# EAGLE design schema project robot (EAGLE 8.7.0)
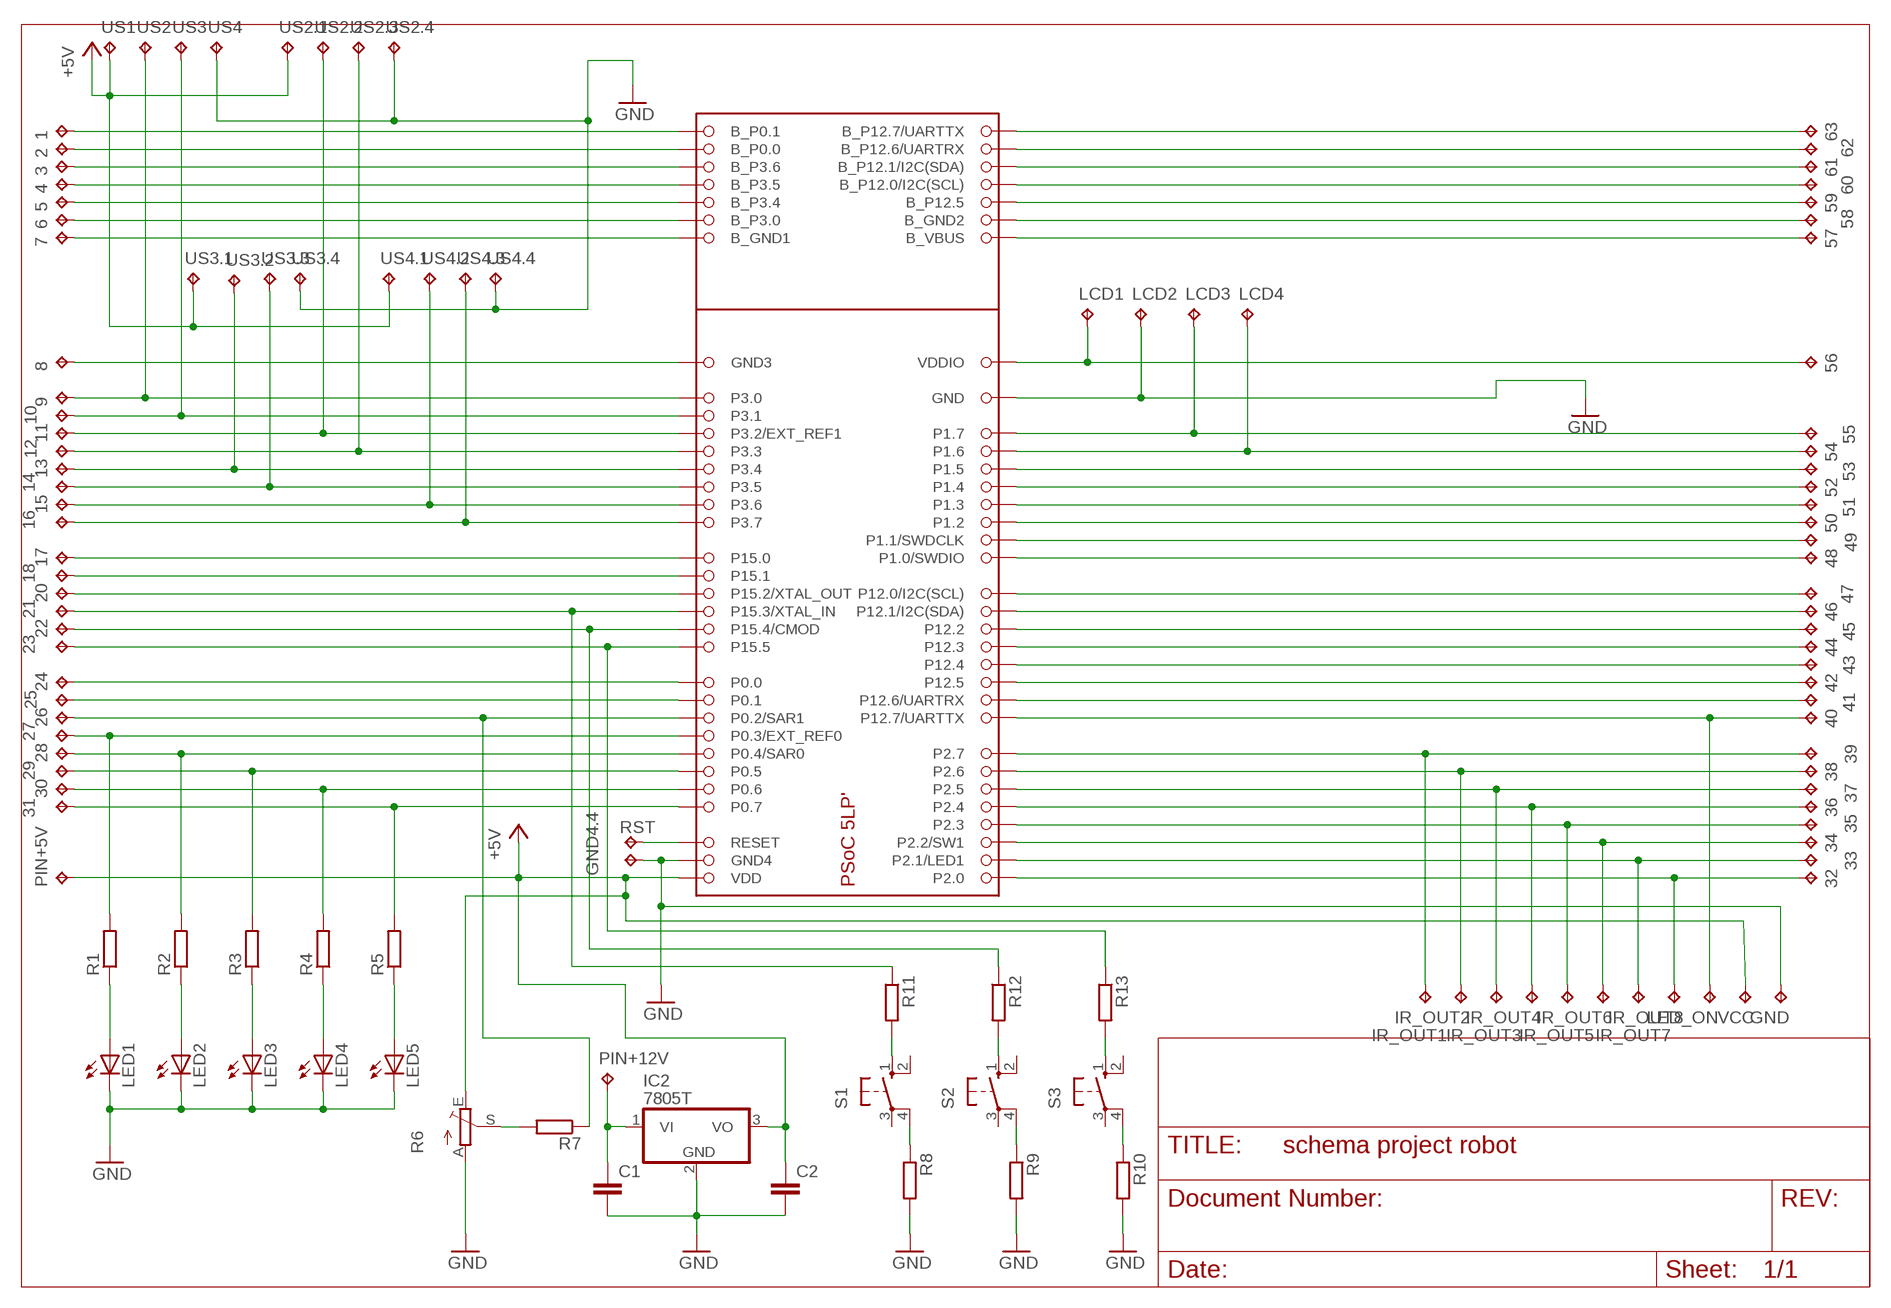
[diagram p0: schematic, sheet 1]

## Parts
1  TPPAD1-13Y  [P1-13Y]
2  TPPAD1-13Y  [P1-13Y]
3  TPPAD1-13Y  [P1-13Y]
4  TPPAD1-13Y  [P1-13Y]
5  TPPAD1-13Y  [P1-13Y]
6  TPPAD1-13Y  [P1-13Y]
7  TPPAD1-13Y  [P1-13Y]
8  TPPAD1-13Y  [P1-13Y]
9  TPPAD1-13Y  [P1-13Y]
10  TPPAD1-13Y  [P1-13Y]
11  TPPAD1-13Y  [P1-13Y]
12  TPPAD1-13Y  [P1-13Y]
13  TPPAD1-13Y  [P1-13Y]
14  TPPAD1-13Y  [P1-13Y]
15  TPPAD1-13Y  [P1-13Y]
16  TPPAD1-13Y  [P1-13Y]
17  TPPAD1-13Y  [P1-13Y]
18  TPPAD1-13Y  [P1-13Y]
20  TPPAD1-13Y  [P1-13Y]
21  TPPAD1-13Y  [P1-13Y]
22  TPPAD1-13Y  [P1-13Y]
23  TPPAD1-13Y  [P1-13Y]
24  TPPAD1-13Y  [P1-13Y]
25  TPPAD1-13Y  [P1-13Y]
26  TPPAD1-13Y  [P1-13Y]
27  TPPAD1-13Y  [P1-13Y]
28  TPPAD1-13Y  [P1-13Y]
29  TPPAD1-13Y  [P1-13Y]
30  TPPAD1-13Y  [P1-13Y]
31  TPPAD1-13Y  [P1-13Y]
32  TPPAD1-13Y  [P1-13Y]
33  TPPAD1-13Y  [P1-13Y]
34  TPPAD1-13Y  [P1-13Y]
35  TPPAD1-13Y  [P1-13Y]
36  TPPAD1-13Y  [P1-13Y]
37  TPPAD1-13Y  [P1-13Y]
38  TPPAD1-13Y  [P1-13Y]
39  TPPAD1-13Y  [P1-13Y]
40  TPPAD1-13Y  [P1-13Y]
41  TPPAD1-13Y  [P1-13Y]
42  TPPAD1-13Y  [P1-13Y]
43  TPPAD1-13Y  [P1-13Y]
44  TPPAD1-13Y  [P1-13Y]
45  TPPAD1-13Y  [P1-13Y]
46  TPPAD1-13Y  [P1-13Y]
47  TPPAD1-13Y  [P1-13Y]
48  TPPAD1-13Y  [P1-13Y]
49  TPPAD1-13Y  [P1-13Y]
50  TPPAD1-13Y  [P1-13Y]
51  TPPAD1-13Y  [P1-13Y]
52  TPPAD1-13Y  [P1-13Y]
53  TPPAD1-13Y  [P1-13Y]
54  TPPAD1-13Y  [P1-13Y]
55  TPPAD1-13Y  [P1-13Y]
56  TPPAD1-13Y  [P1-13Y]
57  TPPAD1-13Y  [P1-13Y]
58  TPPAD1-13Y  [P1-13Y]
59  TPPAD1-13Y  [P1-13Y]
60  TPPAD1-13Y  [P1-13Y]
61  TPPAD1-13Y  [P1-13Y]
62  TPPAD1-13Y  [P1-13Y]
63  TPPAD1-13Y  [P1-13Y]
C1  C-EU050-035X075  [C050-035X075]
C2  C-EU050-035X075  [C050-035X075]
DEVICE1  CYPRESSFOOTPRINT_CYPRESS  [CYPRESSFOOTPRINT_CYPRESSFOOTPRINT]
GND  TPPAD1-13Y  [P1-13Y]
GND4.4  TPPAD1-13Y  [P1-13Y]
IC2  7805T  [TO220H]
IR_OUT1  TPPAD1-13Y  [P1-13Y]
IR_OUT2  TPPAD1-13Y  [P1-13Y]
IR_OUT3  TPPAD1-13Y  [P1-13Y]
IR_OUT4  TPPAD1-13Y  [P1-13Y]
IR_OUT5  TPPAD1-13Y  [P1-13Y]
IR_OUT6  TPPAD1-13Y  [P1-13Y]
IR_OUT7  TPPAD1-13Y  [P1-13Y]
IR_OUT8  TPPAD1-13Y  [P1-13Y]
LCD1  TPPAD1-13Y  [P1-13Y]
LCD2  TPPAD1-13Y  [P1-13Y]
LCD3  TPPAD1-13Y  [P1-13Y]
LCD4  TPPAD1-13Y  [P1-13Y]
LED1  LED5MM  [LED5MM]
LED2  LED5MM  [LED5MM]
LED3  LED5MM  [LED5MM]
LED4  LED5MM  [LED5MM]
LED5  LED5MM  [LED5MM]
LED_ON  TPPAD1-13Y  [P1-13Y]
PIN+5V  TPPAD1-13Y  [P1-13Y]
PIN+12V  TPPAD1-13Y  [P1-13Y]
R1  R-EU_0204/7  [0204/7]
R2  R-EU_0204/7  [0204/7]
R3  R-EU_0204/7  [0204/7]
R4  R-EU_0204/7  [0204/7]
R5  R-EU_0204/7  [0204/7]
R6  TRIM_EU-CIP20C-6MM  [CIP20C-6MM]
R7  R-EU_0204/7  [0204/7]
R8  R-EU_0204/7  [0204/7]
R9  R-EU_0204/7  [0204/7]
R10  R-EU_0204/7  [0204/7]
R11  R-EU_0204/7  [0204/7]
R12  R-EU_0204/7  [0204/7]
R13  R-EU_0204/7  [0204/7]
RST  TPPAD1-13Y  [P1-13Y]
S1  10-XX  [B3F-10XX]
S2  10-XX  [B3F-10XX]
S3  10-XX  [B3F-10XX]
US1  TPPAD1-13Y  [P1-13Y]
US2  TPPAD1-13Y  [P1-13Y]
US2.1  TPPAD1-13Y  [P1-13Y]
US2.2  TPPAD1-13Y  [P1-13Y]
US2.3  TPPAD1-13Y  [P1-13Y]
US2.4  TPPAD1-13Y  [P1-13Y]
US3  TPPAD1-13Y  [P1-13Y]
US3.1  TPPAD1-13Y  [P1-13Y]
US3.2  TPPAD1-13Y  [P1-13Y]
US3.3  TPPAD1-13Y  [P1-13Y]
US3.4  TPPAD1-13Y  [P1-13Y]
US4  TPPAD1-13Y  [P1-13Y]
US4.1  TPPAD1-13Y  [P1-13Y]
US4.2  TPPAD1-13Y  [P1-13Y]
US4.3  TPPAD1-13Y  [P1-13Y]
US4.4  TPPAD1-13Y  [P1-13Y]
VCC  TPPAD1-13Y  [P1-13Y]

## Nets
+5V: C2.1 DEVICE1.VVD(VDD) IC2.3(VO) PIN+5V.TP R6.E US1.TP US2.1.TP US3.1.TP US4.1.TP VCC.TP
GND: C1.2 C2.2 DEVICE1.GND DEVICE1.GND4 GND4.4.TP GND.TP IC2.2(GND) LCD2.TP LED1.K(C) LED2.K(C) LED3.K(C) LED4.K(C) LED5.K(C) R6.A R8.2 R9.2 R10.2 US2.4.TP US3.4.TP US4.4.TP US4.TP
N$1: LED1.A R1.1
N$2: LED2.A R2.1
N$3: LED3.A R3.1
N$4: LED4.A R4.1
N$5: LED5.A R5.1
N$6: 31.TP DEVICE1.P0.7 R5.2
N$7: 30.TP DEVICE1.P0.6 R4.2
N$8: 29.TP DEVICE1.P0.5 R3.2
N$9: 25.TP DEVICE1.P0.1
N$10: 24.TP DEVICE1.P0.0
N$11: 1.TP DEVICE1.B_P0.1
N$12: 2.TP DEVICE1.B_P0.0
N$13: 3.TP DEVICE1.B_P3.6
N$14: 4.TP DEVICE1.B_P3.5
N$15: 5.TP DEVICE1.B_P3.4
N$16: 6.TP DEVICE1.B_P3.0
N$17: 7.TP DEVICE1.B_GND1
N$18: 8.TP DEVICE1.GND3
N$19: 9.TP DEVICE1.P3.0 US2.TP
N$20: 10.TP DEVICE1.P3.1 US3.TP
N$21: 11.TP DEVICE1.P3.2(P3.2/EXT_REF1) US2.2.TP
N$22: 12.TP DEVICE1.P3.3 US2.3.TP
N$23: 16.TP DEVICE1.P3.7 US4.3.TP
N$24: 15.TP DEVICE1.P3.6 US4.2.TP
N$25: C1.1 IC2.1(VI) PIN+12V.TP
N$26: 14.TP DEVICE1.P3.5 US3.3.TP
N$27: 17.TP DEVICE1.P15.0
N$28: 18.TP DEVICE1.P15.1
N$29: 20.TP DEVICE1.P15.2/XTAL_OUT
N$30: 21.TP DEVICE1.P15.3/XTAL_IN R11.1
N$31: 22.TP DEVICE1.P15.4/CMOD R12.1
N$32: 23.TP DEVICE1.P15.5 R13.1
N$33: 26.TP DEVICE1.P0.2/SAR1 R7.1
N$34: 27.TP DEVICE1.P0.3/EXT_REF0 R1.2
N$35: 28.TP DEVICE1.P0.4/SAR0 R2.2
N$36: DEVICE1.RESET RST.TP
N$37: 13.TP DEVICE1.P3.4 US3.2.TP
N$38: 32.TP DEVICE1.P2.0 IR_OUT8.TP
N$39: 33.TP DEVICE1.P2.1/LED1 IR_OUT7.TP
N$40: 34.TP DEVICE1.P2.2/SW1 IR_OUT6.TP
N$41: 35.TP DEVICE1.P2.3 IR_OUT5.TP
N$42: 36.TP DEVICE1.P2.4 IR_OUT4.TP
N$43: 37.TP DEVICE1.P2.5 IR_OUT3.TP
N$44: 38.TP DEVICE1.P2.6 IR_OUT2.TP
N$45: 39.TP DEVICE1.P2.7 IR_OUT1.TP
N$46: 40.TP DEVICE1.P12.7/UARTTX LED_ON.TP
N$47: 41.TP DEVICE1.P12.6/UARTRX
N$48: 42.TP DEVICE1.P12.5
N$49: 43.TP DEVICE1.P12.4
N$50: 44.TP DEVICE1.P12.3
N$51: 45.TP DEVICE1.P12.2
N$52: 46.TP DEVICE1.P12.1/I2C(SDA)
N$53: 47.TP DEVICE1.P12.0/I2C(SCL)
N$54: 48.TP DEVICE1.P1.0/SWDIO
N$55: 49.TP DEVICE1.P1.1/SWDCLK
N$56: 50.TP DEVICE1.P1.2
N$57: 51.TP DEVICE1.P1.3
N$58: 52.TP DEVICE1.P1.4
N$59: 53.TP DEVICE1.P1.5
N$60: 54.TP DEVICE1.P1.6 LCD4.TP
N$61: 55.TP DEVICE1.P1.7 LCD3.TP
N$62: R6.S R7.2
N$63: 57.TP DEVICE1.B_VBUS
N$64: 58.TP DEVICE1.B_GND2
N$65: 59.TP DEVICE1.B_P12.5
N$66: 60.TP DEVICE1.B_12.0/I2C(SCL)(B_P12.0/I2C(SCL))
N$67: 61.TP DEVICE1.B_12.1/I2C(SDA)(B_P12.1/I2C(SDA))
N$68: 62.TP DEVICE1.B_12.6/UARTRX(B_P12.6/UARTRX)
N$69: 63.TP DEVICE1.B_12.7/UARTTX(B_P12.7/UARTTX)
N$70: R8.1 S1.4(P1)
N$71: R9.1 S2.4(P1)
N$72: R10.1 S3.4(P1)
N$73: R13.2 S3.1(S)
N$74: R12.2 S2.1(S)
N$75: R11.2 S1.1(S)
N$76: 56.TP DEVICE1.VDDIO LCD1.TP
Unconnected: S1.2(S1) S1.3(P) S2.2(S1) S2.3(P) S3.2(S1) S3.3(P)

## Library data of the parts
1-18 20-63 GND GND4.4 IR_OUT1-IR_OUT8 LCD1-LCD4 LED_ON PIN+5V PIN+12V RST US1 US2 US2.1-US2.4 US3 US3.1-US3.4 US4 US4.1-US4.4 VCC = testpad:TP: Test pad
C1 C2 = rcl:C-EU: CAPACITOR, European symbol; SPICEPREFIX: C
DEVICE1 = Board_1_23:CYPRESSFOOTPRINT_CYPRESS
IC2 = linear:78*: Positive VOLTAGE REGULATOR Source: http://cache.national.com/ds/LM/LM78L05.pdf http://www.fairchildsemi.com/ds/LM/LM7805.pdf
LED1-LED5 = led:LED: LED OSRAM: - CHIPLED LG R971, LG N971, LY N971, LG Q971, LY Q971, LO R971, LY R971 LH N974, LH R974 LS Q976, LO Q976, LY Q976 LO Q996 - Hyper CHIPLED LW Q18S LB Q993, LB Q99A, LB R99A - SideLED LS A670, LO A670, LY A670, LG A670, LP A670 LB A673, LV A673, LT A673, LW A673 LH A674 LY A675 LS A676, LA A676, LO A676, LY A676, LW A676 LS A679, LY A679, LG A679 - Hyper Micro SIDELED® LS Y876, LA Y876, LO Y876, LY Y876 LT Y87S - SmartLED LW L88C, LW L88S LB L89C, LB L89S, LG L890 LS L89K, LO L89K, LY L89K LS L896, LA L896, LO L896, LY L896 - TOPLED LS T670, LO T670, LY T670, LG T670, LP T670 LSG T670, LSP T670, LSY T670, LOP T670, LYG T670 LG T671, LOG T671, LSG T671 LB T673, LV T673, LT T673, LW T673 LH T674 LS T676, LA T676, LO T676, LY T676, LB T676, LH T676, LSB T676, LW T676 LB T67C, LV T67C, LT T67C, LS T67K, LO T67K, LY T67K, LW E67C LS E67B, LA E67B, LO E67B, LY E67B, LB E67C, LV E67C, LT E67C LW T67C LS T679, LY T679, LG T679 LS T770, LO T770, LY T770, LG T770, LP T770 LB T773, LV T773, LT T773, LW T773 LH T774 LS E675, LA E675, LY E675, LS T675 LS T776, LA T776, LO T776, LY T776, LB T776 LHGB T686 LT T68C, LB T68C - Hyper Mini TOPLED® LB M676 - Mini TOPLED Santana® LG M470 LS M47K, LO M47K, LY M47K Source: http://www.osram.convergy.de LUXEON: - LUMILED® LXK2-PW12-R00, LXK2-PW12-S00, LXK2-PW14-U00, LXK2-PW14-V00 LXK2-PM12-R00, LXK2-PM12-S00, LXK2-PM14-U00 LXK2-PE12-Q00, LXK2-PE12-R00, LXK2-PE12-S00, LXK2-PE14-T00, LXK2-PE14-U00 LXK2-PB12-K00, LXK2-PB12-L00, LXK2-PB12-M00, LXK2-PB14-N00, LXK2-PB14-P00, LXK2-PB14-Q00 LXK2-PR12-L00, LXK2-PR12-M00, LXK2-PR14-Q00, LXK2-PR14-R00 LXK2-PD12-Q00, LXK2-PD12-R00, LXK2-PD12-S00 LXK2-PH12-R00, LXK2-PH12-S00 LXK2-PL12-P00, LXK2-PL12-Q00, LXK2-PL12-R00 Source: www.luxeon.com KINGBRIGHT: KA-3528ASYC Source: www.kingbright.com
R1-R5 R7-R13 = rcl:R-EU_: RESISTOR, European symbol; SPICEPREFIX: R
R6 = pot:TRIM_EU-: POTENTIOMETER
S1-S3 = switch-omron:10-XX: OMRON SWITCH; MPN: B3F-1000; OC_FARNELL: 176432; OC_NEWARK: 36M3542

## Board
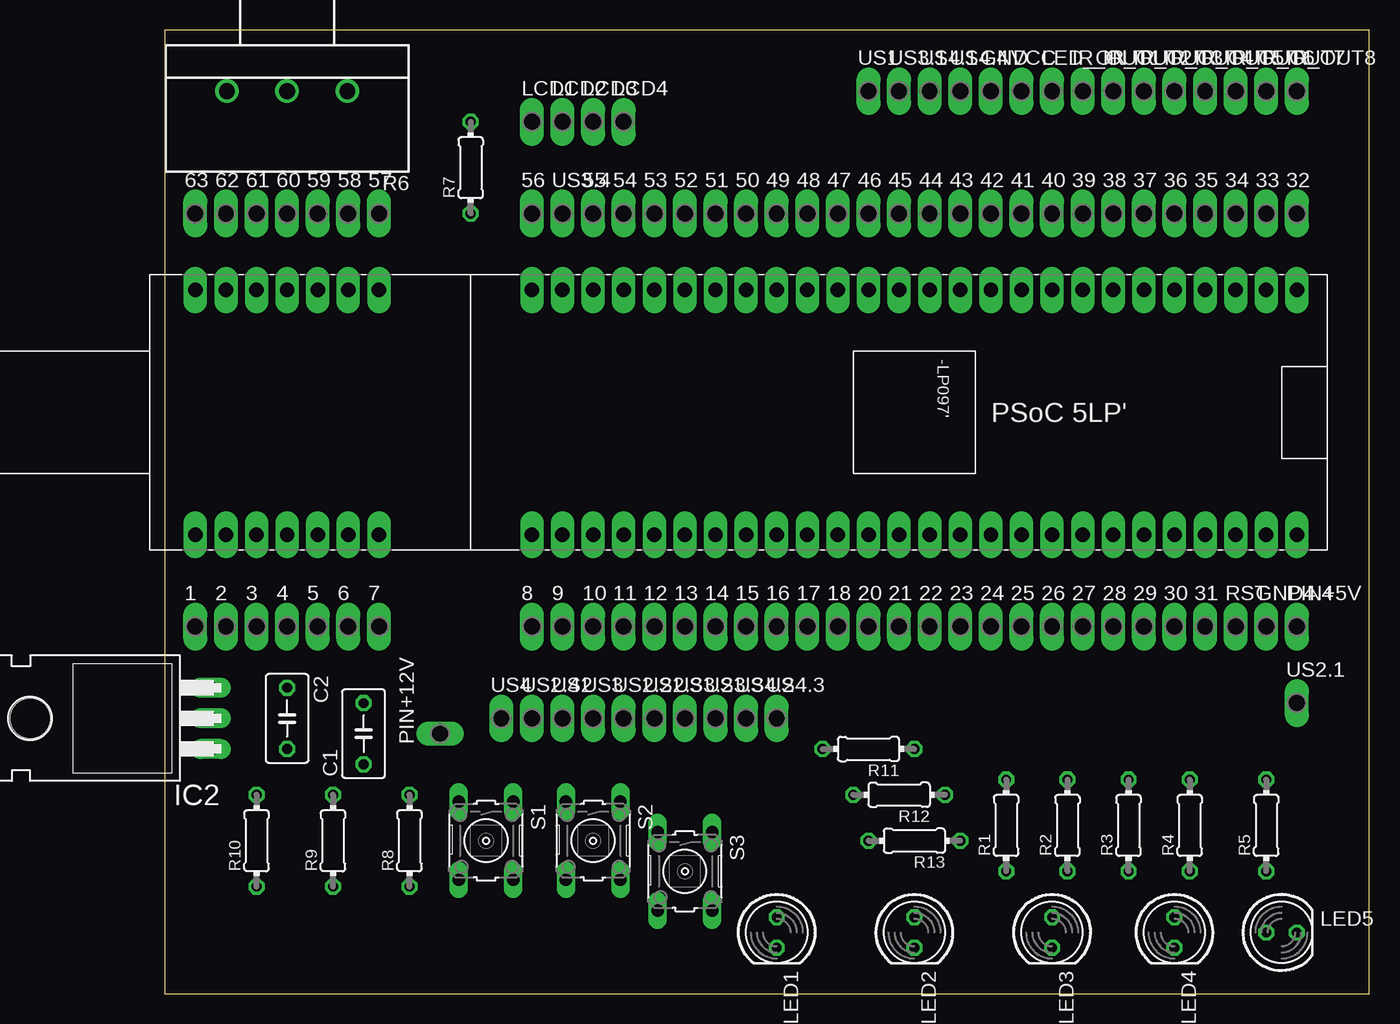
[diagram p1: board, top side]
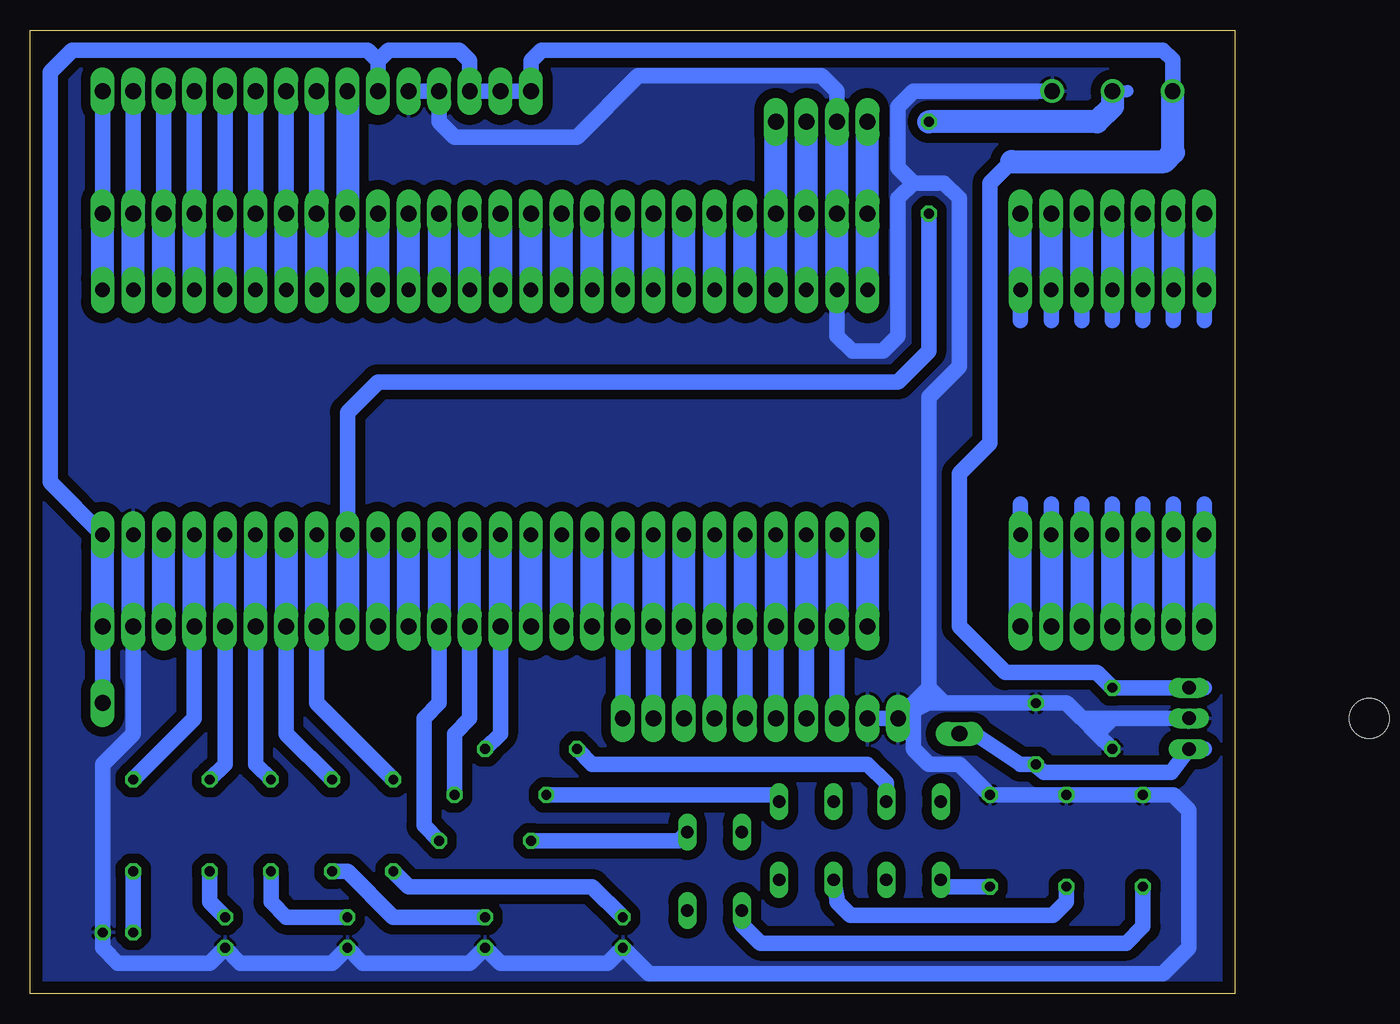
[diagram p2: board, bottom side, seen from below]

Size 100 x 80 mm. Coordinates in mm from the lower left corner, seen from the top.
Outline: 0,0 100,0 100,80 0,80 0,0
Copper layers (1*16): Top 0.035mm / dielectric 1.5mm / Bottom 0.035mm
Design rules "default": minimum track width 6mil, minimum drill 0.35mm, track to track 6mil, track to pad 6mil, pad to pad 6mil, via to via 6mil, smd to smd 6mil, copper to edge 40mil, drill to drill 6mil, minimum pad ring 10mil, minimum via ring 8mil, stop-mask expansion 4mil, vias tented up to drill 0mil, thermal gap 10mil

### Footprints (pad centres in the part's own frame; a part is rotated, then mirrored left to right if it is on the bottom)
P1-13Y = drill 1.321 pad 1.905 long: TP 0,0
C050-035X075 = drill 0.813 octagon: 1 -2.54,0; 2 2.54,0
CYPRESSFOOTPRINT_CYPRESSFOOTPRINT = drill 1.2 pad 1.93 long: B_12.0/I2C(SCL) -36.83,10.16; B_12.1/I2C(SDA) -39.37,10.16; B_12.6/UARTRX -41.91,10.16; B_12.7/UARTTX -44.45,10.16; B_GND1 -29.21,-10.16; B_GND2 -31.75,10.16; B_P0.0 -41.91,-10.16; B_P0.1 -44.45,-10.16; B_P3.0 -31.75,-10.16; B_P3.4 -34.29,-10.16; B_P3.5 -36.83,-10.16; B_P3.6 -39.37,-10.16; B_P12.5 -34.29,10.16; B_VBUS -29.21,10.16; GND -13.97,10.16; GND3 -16.51,-10.16; GND4 44.45,-10.16; P0.0 21.59,-10.16; P0.1 24.13,-10.16; P0.2/SAR1 26.67,-10.16; P0.3/EXT_REF0 29.21,-10.16; P0.4/SAR0 31.75,-10.16; P0.5 34.29,-10.16; P0.6 36.83,-10.16; P0.7 39.37,-10.16; P1.0/SWDIO 6.35,10.16; P1.1/SWDCLK 3.81,10.16; P1.2 1.27,10.16; P1.3 -1.27,10.16; P1.4 -3.81,10.16; P1.5 -6.35,10.16; P1.6 -8.89,10.16; P1.7 -11.43,10.16; P2.0 46.99,10.16; P2.1/LED1 44.45,10.16; P2.2/SW1 41.91,10.16; P2.3 39.37,10.16; P2.4 36.83,10.16; P2.5 34.29,10.16; P2.6 31.75,10.16; P2.7 29.21,10.16; P3.0 -13.97,-10.16; P3.1 -11.43,-10.16; P3.2 -8.89,-10.16; P3.3 -6.35,-10.16; P3.4 -3.81,-10.16; P3.5 -1.27,-10.16; P3.6 1.27,-10.16; P3.7 3.81,-10.16; P12.0/I2C(SCL) 8.89,10.16; P12.1/I2C(SDA) 11.43,10.16; P12.2 13.97,10.16; P12.3 16.51,10.16; P12.4 19.05,10.16; P12.5 21.59,10.16; P12.6/UARTRX 24.13,10.16; P12.7/UARTTX 26.67,10.16; P15.0 6.35,-10.16; P15.1 8.89,-10.16; P15.2/XTAL_OUT 11.43,-10.16; P15.3/XTAL_IN 13.97,-10.16; P15.4/CMOD 16.51,-10.16; P15.5 19.05,-10.16; RESET 41.91,-10.16; VDDIO -16.51,10.16; VVD 46.99,-10.16
TO220H = drill 1.118 long: 1 -2.54,-10.16; 2 0,-10.16; 3 2.54,-10.16 | hole 3.302: 0,4.826
LED5MM = drill 0.813 octagon: A -1.27,0; K 1.27,0
0204/7 = drill 0.813 octagon: 1 -3.81,0; 2 3.81,0
CIP20C-6MM = drill 1.3 pad 1.93: A -5,0; E 5,0; S 0,0
B3F-10XX = drill 1.016 long: 1 -3.251,2.261; 2 3.251,2.261; 3 -3.251,-2.261; 4 3.251,-2.261

### Placement (x,y rotation side)
1  2.54,30.48 0 top
2  5.08,30.48 0 top
3  7.62,30.48 0 top
4  10.16,30.48 0 top
5  12.7,30.48 0 top
6  15.24,30.48 0 top
7  17.78,30.48 0 top
8  30.48,30.48 0 top
9  33.02,30.48 0 top
10  35.56,30.48 0 top
11  38.1,30.48 0 top
12  40.64,30.48 0 top
13  43.18,30.48 0 top
14  45.72,30.48 0 top
15  48.26,30.48 0 top
16  50.8,30.48 0 top
17  53.34,30.48 0 top
18  55.88,30.48 0 top
20  58.42,30.48 0 top
21  60.96,30.48 0 top
22  63.5,30.48 0 top
23  66.04,30.48 0 top
24  68.58,30.48 0 top
25  71.12,30.48 0 top
26  73.66,30.48 0 top
27  76.2,30.48 0 top
28  78.74,30.48 0 top
29  81.28,30.48 0 top
30  83.82,30.48 0 top
31  86.36,30.48 0 top
32  93.98,64.77 0 top
33  91.44,64.77 0 top
34  88.9,64.77 0 top
35  86.36,64.77 0 top
36  83.82,64.77 0 top
37  81.28,64.77 0 top
38  78.74,64.77 0 top
39  76.2,64.77 0 top
40  73.66,64.77 0 top
41  71.12,64.77 0 top
42  68.58,64.77 0 top
43  66.04,64.77 0 top
44  63.5,64.77 0 top
45  60.96,64.77 0 top
46  58.42,64.77 0 top
47  55.88,64.77 0 top
48  53.34,64.77 0 top
49  50.8,64.77 0 top
50  48.26,64.77 0 top
51  45.72,64.77 0 top
52  43.18,64.77 0 top
53  40.64,64.77 0 top
54  38.1,64.77 0 top
55  35.56,64.77 0 top
56  30.48,64.77 0 top
57  17.78,64.77 0 top
58  15.24,64.77 0 top
59  12.7,64.77 0 top
60  10.16,64.77 0 top
61  7.62,64.77 0 top
62  5.08,64.77 0 top
63  2.54,64.77 0 top
C1  16.51,21.59 90 top
C2  10.16,22.86 270 top
DEVICE1  46.99,48.26 0 top
GND  68.58,74.93 0 top
GND4.4  91.44,30.48 0 top
IC2  -6.35,22.86 90 top
IR_OUT1  76.2,74.93 0 top
IR_OUT2  78.74,74.93 0 top
IR_OUT3  81.28,74.93 0 top
IR_OUT4  83.82,74.93 0 top
IR_OUT5  86.36,74.93 0 top
IR_OUT6  88.9,74.93 0 top
IR_OUT7  91.44,74.93 0 top
IR_OUT8  93.98,74.93 0 top
LCD1  30.48,72.39 0 top
LCD2  33.02,72.39 0 top
LCD3  35.56,72.39 0 top
LCD4  38.1,72.39 0 top
LED1  50.8,5.08 270 top
LED2  62.23,5.08 270 top
LED3  73.66,5.08 270 top
LED4  83.82,5.08 270 top
LED5  92.71,5.08 0 top
LED_ON  73.66,74.93 0 top
PIN+5V  93.98,30.48 0 top
PIN+12V  22.86,21.59 90 top
R1  69.85,13.97 90 top
R2  74.93,13.97 90 top
R3  80.01,13.97 90 top
R4  85.09,13.97 90 top
R5  91.44,13.97 90 top
R6  10.16,74.93 180 top
R7  25.4,68.58 90 top
R8  20.32,12.7 90 top
R9  13.97,12.7 90 top
R10  7.62,12.7 90 top
R11  58.42,20.32 180 top
R12  60.96,16.51 180 top
R13  62.23,12.7 180 top
RST  88.9,30.48 0 top
S1  26.67,12.7 270 top
S2  35.56,12.7 270 top
S3  43.18,10.16 270 top
US1  58.42,74.93 0 top
US2  33.02,22.86 0 top
US2.1  93.98,24.13 0 top
US2.2  38.1,22.86 0 top
US2.3  40.64,22.86 0 top
US2.4  30.48,22.86 0 top
US3  35.56,22.86 0 top
US3.1  60.96,74.93 0 top
US3.2  43.18,22.86 0 top
US3.3  45.72,22.86 0 top
US3.4  33.02,64.77 0 top
US4  27.94,22.86 0 top
US4.1  63.5,74.93 0 top
US4.2  48.26,22.86 0 top
US4.3  50.8,22.86 0 top
US4.4  66.04,74.93 0 top
VCC  71.12,74.93 0 top

### Tracks (layer width: path | path; a pad name or v marks a point on that pad's centre or on a via)
+5V
  Bottom 1.27: US3.1.TP US4.1.TP | US1.TP US3.1.TP | US1.TP 58.42,77.47 57.54,78.35 5.96,78.35 5.16,77.55 R6.E | 71.12,77.47 70.24,78.35 64.38,78.35 63.5,77.47 US4.1.TP | 71.12,77.47 72,78.35 96.52,78.35 98.35,76.52 98.35,42.47 DEVICE1.VVD | PIN+5V.TP US2.1.TP 93.98,22.86 | 5.08,69.85 5.16,69.93 | 18.54,69.09 20.32,67.31 20.32,45.72 22.86,43.18 22.86,30.48 19.05,26.67 11.43,26.67 C2.1 IC2.3 2.54,25.4 | 71.12,77.47 VCC.TP 71.12,73.66 | US1.TP 58.42,73.66 | US4.1.TP 63.5,73.66 | US3.1.TP 60.96,76.2
  Bottom 1.905: PIN+5V.TP DEVICE1.VVD | 5.08,69.85 5.84,69.09 18.54,69.09 | 5.16,69.93 R6.E
GND
  Bottom 1.27: GND4.4.TP 91.44,21.59 93.98,19.05 LED5.K 93.98,3.81 92.71,2.54 85.09,2.54 LED4.K 82.55,2.54 74.93,2.54 LED3.K 72.39,2.54 63.5,2.54 LED2.K 60.96,2.54 52.07,2.54 LED1.K 48.64,1.65 5.97,1.65 3.81,3.81 3.81,15.24 5.08,16.51 R10.2 R9.2 R8.2 22.86,19.05 25.4,19.05 26.67,20.32 26.67,21.59 | US4.4.TP GND.TP 68.58,76.2 | US4.TP US2.4.TP 30.48,21.59 | DEVICE1.GND 33.02,54.61 31.75,53.34 29.21,53.34 27.94,54.61 27.94,66.04 26.67,67.31 | 26.67,67.31 24.13,67.31 22.86,66.04 22.86,52.07 25.4,49.53 25.4,25.4 | 25.4,25.4 25.4,24.13 | 25.4,24.13 US4.TP | 26.67,67.31 27.94,68.58 27.94,73.66 26.67,74.93 R6.A | LCD2.TP 33.02,74.93 34.29,76.2 49.53,76.2 54.61,71.12 64.77,71.12 66.04,72.39 US4.4.TP | 12.7,22.86 13.97,24.13 C1.2 24.13,24.13 | 12.7,22.86 11.43,21.59 | 11.43,21.59 C2.2 | IC2.2 10.16,22.86 | 10.16,22.86 12.7,22.86 | 24.13,24.13 25.4,25.4 | 24.13,24.13 25.4,24.13 | 26.67,24.13 26.67,21.59 | 26.67,21.59 US4.TP | US4.TP 25.4,25.4 | 10.16,22.86 11.43,21.59 | US4.4.TP 66.04,76.2
  Bottom 1.905: GND4.4.TP DEVICE1.GND4 | DEVICE1.GND US3.4.TP LCD2.TP
  pour Bottom (isolate 0.813): -1.27,81.28 101.6,81.28 101.6,-1.27 -1.27,-1.27
N$1
  Bottom 1.27: R1.1 68.58,8.89 53.34,8.89 LED1.A
N$2
  Bottom 1.27: LED2.A 69.85,6.35 73.66,10.16 R2.1
N$3
  Bottom 1.27: R3.1 80.01,7.62 78.74,6.35 LED3.A
N$4
  Bottom 1.27: R4.1 85.09,7.62 LED4.A
N$5
  Bottom 1.27: R5.1 LED5.A
N$6
  Bottom 1.27: R5.2 86.36,22.86 31.TP | DEVICE1.P0.7 86.36,39.37
  Bottom 1.905: 31.TP DEVICE1.P0.7
N$7
  Bottom 1.27: R4.2 83.82,19.05 30.TP | DEVICE1.P0.6 83.82,39.37
  Bottom 1.905: 30.TP DEVICE1.P0.6
N$8
  Bottom 1.27: R3.2 81.28,19.05 29.TP | DEVICE1.P0.5 81.28,39.37
  Bottom 1.905: 29.TP DEVICE1.P0.5
N$9
  Bottom 1.27: 25.TP 71.12,29.21 | DEVICE1.P0.1 71.12,39.37
  Bottom 1.905: DEVICE1.P0.1 25.TP
N$10
  Bottom 1.27: 24.TP 68.58,29.21 | DEVICE1.P0.0 68.58,39.37
  Bottom 1.905: 24.TP DEVICE1.P0.0
N$11
  Bottom 1.27: DEVICE1.B_P0.1 2.54,40.64 | 1.TP 2.54,29.21
  Bottom 1.905: 1.TP DEVICE1.B_P0.1
N$12
  Bottom 1.27: DEVICE1.B_P0.0 5.08,40.64 | 2.TP 5.08,29.21
  Bottom 1.905: DEVICE1.B_P0.0 2.TP
N$13
  Bottom 1.27: DEVICE1.B_P3.6 7.62,40.64 | 3.TP 7.62,29.21
  Bottom 1.905: DEVICE1.B_P3.6 3.TP
N$14
  Bottom 1.27: DEVICE1.B_P3.5 10.16,40.64 | 4.TP 10.16,29.21
  Bottom 1.905: DEVICE1.B_P3.5 4.TP
N$15
  Bottom 1.27: DEVICE1.B_P3.4 12.7,40.64 | 5.TP 12.7,29.21
  Bottom 1.905: DEVICE1.B_P3.4 5.TP
N$16
  Bottom 1.27: DEVICE1.B_P3.0 15.24,40.64 | 6.TP 15.24,29.21
  Bottom 1.905: DEVICE1.B_P3.0 6.TP
N$17
  Bottom 1.27: DEVICE1.B_GND1 17.78,40.64 | 7.TP 17.78,29.21
  Bottom 1.905: 7.TP DEVICE1.B_GND1
N$18
  Bottom 1.27: DEVICE1.GND3 30.48,39.37
  Bottom 1.905: DEVICE1.GND3 8.TP
N$19
  Bottom 1.27: 9.TP US2.TP 33.02,21.59 | DEVICE1.P3.0 33.02,39.37
  Bottom 1.905: DEVICE1.P3.0 9.TP
N$20
  Bottom 1.27: 10.TP US3.TP 35.56,21.59 | DEVICE1.P3.1 35.56,39.37
  Bottom 1.905: DEVICE1.P3.1 10.TP
N$21
  Bottom 1.27: 11.TP US2.2.TP 38.1,21.59 | DEVICE1.P3.2 38.1,39.37
  Bottom 1.905: DEVICE1.P3.2 11.TP
N$22
  Bottom 1.27: 12.TP US2.3.TP 40.64,21.59 | DEVICE1.P3.3 40.64,39.37
  Bottom 1.905: DEVICE1.P3.3 12.TP
N$23
  Bottom 1.27: 16.TP US4.3.TP 50.8,21.59 | DEVICE1.P3.7 50.8,39.37
  Bottom 1.905: 16.TP DEVICE1.P3.7
N$24
  Bottom 1.27: 15.TP US4.2.TP 48.26,21.59 | DEVICE1.P3.6 48.26,39.37
  Bottom 1.905: DEVICE1.P3.6 15.TP
N$25
  Bottom 1.27: 21.72,21.59 21.59,21.59 17.78,19.05 C1.1 16.53,18.92 15.84,18.36 5.26,18.36 IC2.1 2.54,20.32 | 21.72,21.59 PIN+12V.TP | 21.72,21.59 21.84,21.72 24,21.72
N$26
  Bottom 1.27: 14.TP US3.3.TP 45.72,21.59 | DEVICE1.P3.5 45.72,39.37
  Bottom 1.905: 14.TP DEVICE1.P3.5
N$27
  Bottom 1.27: 17.TP 53.34,29.21 | DEVICE1.P15.0 53.34,39.37
  Bottom 1.905: 17.TP DEVICE1.P15.0
N$28
  Bottom 1.27: 18.TP 55.88,29.21 | DEVICE1.P15.1 55.88,39.37
  Bottom 1.905: 18.TP DEVICE1.P15.1
N$29
  Bottom 1.27: 20.TP 58.42,29.21 | DEVICE1.P15.2/XTAL_OUT 58.42,39.37
  Bottom 1.905: 20.TP DEVICE1.P15.2/XTAL_OUT
N$30
  Bottom 1.27: 21.TP 60.96,21.59 R11.1 | DEVICE1.P15.3/XTAL_IN 60.96,39.37
  Bottom 1.905: 21.TP DEVICE1.P15.3/XTAL_IN
N$31
  Bottom 1.27: 22.TP 63.5,22.86 64.77,21.59 R12.1 | DEVICE1.P15.4/CMOD 63.5,39.37
  Bottom 1.905: 22.TP DEVICE1.P15.4/CMOD
N$32
  Bottom 1.27: 23.TP 66.04,24.13 67.31,22.86 67.31,13.97 R13.1 | DEVICE1.P15.5 66.04,39.37
  Bottom 1.905: DEVICE1.P15.5 23.TP
N$33
  Bottom 1.27: R7.1 25.4,53.34 27.94,50.8 71.12,50.8 73.66,48.26 DEVICE1.P0.2/SAR1 | 26.TP 73.66,29.21
  Bottom 1.905: DEVICE1.P0.2/SAR1 26.TP
N$34
  Bottom 1.27: R1.2 76.2,24.13 27.TP | DEVICE1.P0.3/EXT_REF0 76.2,39.37
  Bottom 1.905: 27.TP DEVICE1.P0.3/EXT_REF0
N$35
  Bottom 1.27: R2.2 78.74,21.59 28.TP | DEVICE1.P0.4/SAR0 78.74,39.37
  Bottom 1.905: DEVICE1.P0.4/SAR0 28.TP
N$36
  Bottom 1.27: RST.TP 88.9,29.21 | DEVICE1.RESET 88.9,39.37
  Bottom 1.905: RST.TP DEVICE1.RESET
N$37
  Bottom 1.27: 13.TP US3.2.TP 43.18,21.59 | DEVICE1.P3.4 43.18,39.37
  Bottom 1.905: DEVICE1.P3.4 13.TP
N$38
  Bottom 1.27: 32.TP IR_OUT8.TP 93.98,76.2 | DEVICE1.P2.0 93.98,57.15
  Bottom 1.905: DEVICE1.P2.0 32.TP
N$39
  Bottom 1.27: 33.TP IR_OUT7.TP 91.44,76.2 | DEVICE1.P2.1/LED1 91.44,57.15
  Bottom 1.905: DEVICE1.P2.1/LED1 33.TP
N$40
  Bottom 1.27: 34.TP IR_OUT6.TP 88.9,76.2 | DEVICE1.P2.2/SW1 88.9,57.15
  Bottom 1.905: DEVICE1.P2.2/SW1 34.TP
N$41
  Bottom 1.27: 35.TP IR_OUT5.TP 86.36,76.2 | DEVICE1.P2.3 86.36,57.15
  Bottom 1.905: DEVICE1.P2.3 35.TP
N$42
  Bottom 1.27: 36.TP IR_OUT4.TP 83.82,76.2 | DEVICE1.P2.4 83.82,57.15
  Bottom 1.905: DEVICE1.P2.4 36.TP
N$43
  Bottom 1.27: 37.TP IR_OUT3.TP 81.28,76.2 | DEVICE1.P2.5 81.28,57.15
  Bottom 1.905: DEVICE1.P2.5 37.TP
N$44
  Bottom 1.27: 38.TP IR_OUT2.TP 78.74,76.2 | DEVICE1.P2.6 78.74,57.15
  Bottom 1.905: DEVICE1.P2.6 38.TP
N$45
  Bottom 1.27: 39.TP IR_OUT1.TP 76.2,76.2 | DEVICE1.P2.7 76.2,57.15
  Bottom 1.905: DEVICE1.P2.7 39.TP
N$46
  Bottom 1.27: LED_ON.TP 73.66,76.2 | DEVICE1.P12.7/UARTTX 73.66,57.15
  Bottom 1.905: DEVICE1.P12.7/UARTTX 40.TP LED_ON.TP
N$47
  Bottom 1.27: 71.12,63.5 71.12,66.04 | DEVICE1.P12.6/UARTRX 71.12,57.15
  Bottom 1.905: DEVICE1.P12.6/UARTRX 71.12,63.5 41.TP
N$48
  Bottom 1.27: 42.TP 68.58,66.04 | DEVICE1.P12.5 68.58,57.15
  Bottom 1.905: DEVICE1.P12.5 42.TP
N$49
  Bottom 1.27: 43.TP 66.04,66.04 | DEVICE1.P12.4 66.04,57.15
  Bottom 1.905: 43.TP DEVICE1.P12.4
N$50
  Bottom 1.27: 44.TP 63.5,66.04 | DEVICE1.P12.3 63.5,57.15
  Bottom 1.905: DEVICE1.P12.3 44.TP
N$51
  Bottom 1.27: 45.TP 60.96,66.04 | DEVICE1.P12.2 60.96,57.15
  Bottom 1.905: 45.TP DEVICE1.P12.2
N$52
  Bottom 1.27: 46.TP 58.42,66.04 | DEVICE1.P12.1/I2C(SDA) 58.42,57.15
  Bottom 1.905: DEVICE1.P12.1/I2C(SDA) 46.TP
N$53
  Bottom 1.27: 47.TP 55.88,66.04 | DEVICE1.P12.0/I2C(SCL) 55.88,57.15
  Bottom 1.905: DEVICE1.P12.0/I2C(SCL) 47.TP
N$54
  Bottom 1.27: 48.TP 53.34,66.04 | DEVICE1.P1.0/SWDIO 53.34,57.15
  Bottom 1.905: DEVICE1.P1.0/SWDIO 48.TP
N$55
  Bottom 1.27: DEVICE1.P1.1/SWDCLK 50.8,57.15 | 49.TP 50.8,66.04
  Bottom 1.905: DEVICE1.P1.1/SWDCLK 49.TP
N$56
  Bottom 1.27: DEVICE1.P1.2 48.26,57.15 | 50.TP 48.26,66.04
  Bottom 1.905: DEVICE1.P1.2 50.TP
N$57
  Bottom 1.27: DEVICE1.P1.3 45.72,57.15 | 51.TP 45.72,66.04
  Bottom 1.905: DEVICE1.P1.3 51.TP
N$58
  Bottom 1.27: DEVICE1.P1.4 43.18,57.15 | 52.TP 43.18,66.04
  Bottom 1.905: DEVICE1.P1.4 52.TP
N$59
  Bottom 1.27: DEVICE1.P1.5 40.64,57.15 | 53.TP 40.64,66.04
  Bottom 1.905: DEVICE1.P1.5 53.TP
N$60
  Bottom 1.27: LCD4.TP 38.1,73.66 | DEVICE1.P1.6 38.1,57.15
  Bottom 1.905: DEVICE1.P1.6 54.TP LCD4.TP
N$61
  Bottom 1.27: LCD3.TP 35.56,73.66 | DEVICE1.P1.7 35.56,57.15
  Bottom 1.905: DEVICE1.P1.7 55.TP LCD3.TP
N$62
  Bottom 1.016: R6.S 8.89,74.93
  Bottom 1.905: R6.S 10.16,73.66 11.43,72.39 R7.2
N$63
  Bottom 1.27: 57.TP 17.78,66.04 | DEVICE1.B_VBUS 17.78,55.88
  Bottom 1.905: DEVICE1.B_VBUS 57.TP
N$64
  Bottom 1.27: 58.TP 15.24,66.04 | DEVICE1.B_GND2 15.24,55.88
  Bottom 1.905: DEVICE1.B_GND2 58.TP
N$65
  Bottom 1.27: 59.TP 12.7,66.04 | DEVICE1.B_P12.5 12.7,55.88
  Bottom 1.905: DEVICE1.B_P12.5 59.TP
N$66
  Bottom 1.27: 60.TP 10.16,66.04 | DEVICE1.B_12.0/I2C(SCL) 10.16,55.88
  Bottom 1.905: 60.TP DEVICE1.B_12.0/I2C(SCL)
N$67
  Bottom 1.27: 61.TP 7.62,66.04 | DEVICE1.B_12.1/I2C(SDA) 7.62,55.88
  Bottom 1.905: DEVICE1.B_12.1/I2C(SDA) 61.TP
N$68
  Bottom 1.27: 62.TP 5.08,66.04 | DEVICE1.B_12.6/UARTRX 5.08,55.88
  Bottom 1.905: DEVICE1.B_12.6/UARTRX 62.TP
N$69
  Bottom 1.27: 63.TP 2.54,66.04 | DEVICE1.B_12.7/UARTTX 2.54,55.88
  Bottom 1.905: DEVICE1.B_12.7/UARTTX 63.TP
N$70
  Bottom 1.27: R8.1 23.85,8.89 S1.4
N$71
  Bottom 1.27: S2.4 33.02,7.9 33.02,7.62 31.9,6.5 15.09,6.5 13.97,7.62 R9.1
N$72
  Bottom 1.27: S3.4 40.92,5.74 39.37,4.19 9.02,4.19 7.62,5.59 R10.1
N$73
  Bottom 1.27: R13.2 46.15,12.7 S3.1
N$74
  Bottom 1.27: R12.2 38.1,16.51 37.82,16.23 S2.1
N$75
  Bottom 1.27: R11.2 53.34,19.05 30.48,19.05 28.93,17.5 S1.1
N$76
  Bottom 1.27: DEVICE1.VDDIO 30.48,57.15
  Bottom 1.905: DEVICE1.VDDIO 56.TP LCD1.TP
N$77
  Bottom 1.27: 24.13,8.89 24.51,9.27